# EAGLE design sensor (EAGLE 7.6.0)
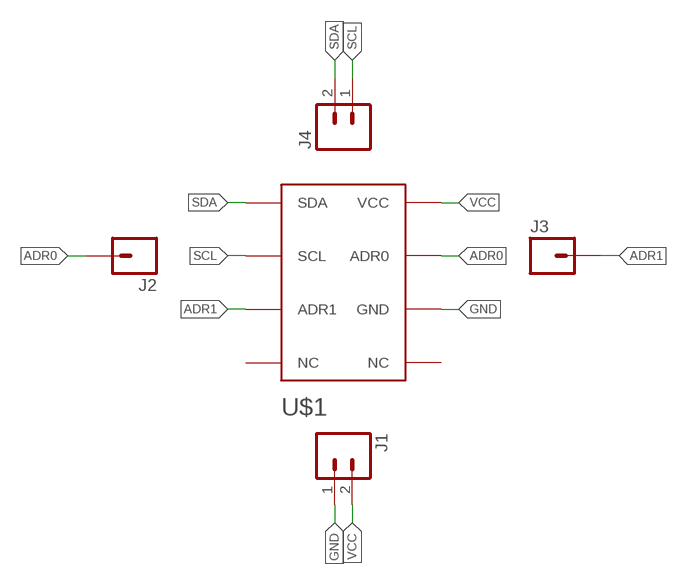
[diagram p0: schematic, sheet 1]

## Parts
J1  M02PTH  [1X02]
J2  M01PTH  [1X01]
J3  M01PTH  [1X01]
J4  M02PTH  [1X02]
U$1  A1454  [TSSOP8]

## Nets
ADR0: J2.1 U$1.2(ADR0)
ADR1: J3.1 U$1.6(ADR1)
GND: J1.1 U$1.3(GND)
SCL: J4.1 U$1.8(SCL)
SDA: J4.2 U$1.7(SDA)
VCC: J1.2 U$1.1(VCC)
Unconnected: U$1.4(NC) U$1.5(NC)

## Library data of the parts
J1 J4 = SparkFun-Connectors:M02: Standard 2-pin 0.1" header. Use with - straight break away headers ( PRT-00116) - right angle break away headers (PRT-00553) - swiss pins (PRT-00743) - machine pins (PRT-00117) - female headers (PRT-00115) Molex polarized connector foot print use with: PRT-08233 with associated crimp pins and housings. 2.54_SCREWTERM for use with PRT-10571. 3.5mm Screw Terminal footprints for PRT-08084 5mm Screw Terminal footprints for use with PRT-08432
J2 J3 = SparkFun-Connectors:M01: Header 1 Standard 1-pin 0.1" header. Use with straight break away headers (SKU : PRT-00116), right angle break away headers (PRT-00553), swiss pins (PRT-00743), machine pins (PRT-00117), and female headers (PRT-00115). SMTSO-256-ET is a "flush mount" nut for a 4-40 screw. The older package used to be too tight, and did not allow it to sit properly thru the drill hit. The latest (0.165DIA) fits nice and snug.
U$1 = analogue:A1454: Magnetic hall effect sensor which has I2C capabilities

## Board
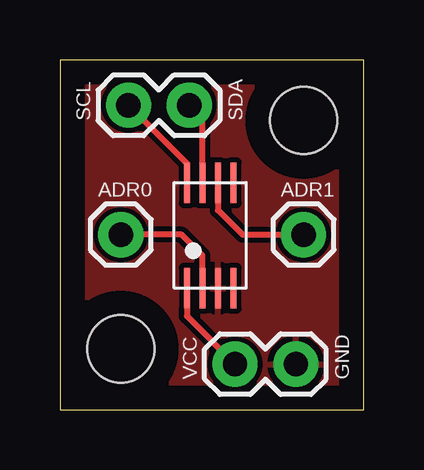
[diagram p1: board, top side]

Size 12.68 x 14.59 mm. Coordinates in mm from the lower left corner, seen from the top.
Outline: 0,0 12.68,0 12.68,14.59 0,14.59 0,0
Copper layers (1*16): Top 0.035mm / dielectric 1.5mm / Bottom 0.035mm
Design rules "default": minimum track width 10mil, minimum drill 24mil, track to track 8mil, track to pad 8mil, pad to pad 8mil, via to via 8mil, smd to smd 8mil, copper to edge 40mil, drill to drill 8mil, minimum pad ring 10mil, minimum via ring 8mil, stop-mask expansion 4mil, vias tented up to drill 0mil, thermal gap 10mil
Holes 2.8 mm at 2.54,2.54 10.16,12.06

### Footprints (pad centres in the part's own frame; a part is rotated, then mirrored left to right if it is on the bottom)
1X02 = drill 1.016 pad 1.88: 1 0,0; 2 2.54,0
1X01 = drill 1.016 pad 1.88: 1 0,0
TSSOP8 = smd 0.25 x 1.7: 1 0.53,-0.01; 2 1.18,-0.01; 3 1.83,-0.01; 4 2.48,-0.01; 5 2.48,4.39; 6 1.83,4.39; 7 1.18,4.39; 8 0.53,4.39

### Placement (x,y rotation side)
J1  9.84,1.91 180 top
J2  2.54,7.3 0 top
J3  10.16,7.3 0 top
J4  2.86,12.7 0 top
U$1  4.76,5.08 0 top

### Tracks (layer width: path | path; a pad name or v marks a point on that pad's centre or on a via)
ADR0
  Top 0.254: U$1.2 5.94,6.44 5.08,7.3 J2.1
ADR1
  Top 0.254: U$1.6 6.59,8.33 7.62,7.3 J3.1
GND
  pour Top: 0,0 12.7,0 12.7,14.92 0,14.92
SCL
  Top 0.254: U$1.8 5.29,10.27 J4.1
SDA
  Top 0.254: U$1.7 5.94,12.15 J4.2
VCC
  Top 0.254: U$1.1 5.29,3.92 J1.2

### Text on the board
tNames: SCL | SDA | ADR0 | ADR1 | VCC | GND
bNames: Hall Effect Breakout Board | Liam Lawrence / 12.16.16